# Altium project screwdriver.PrjPcb
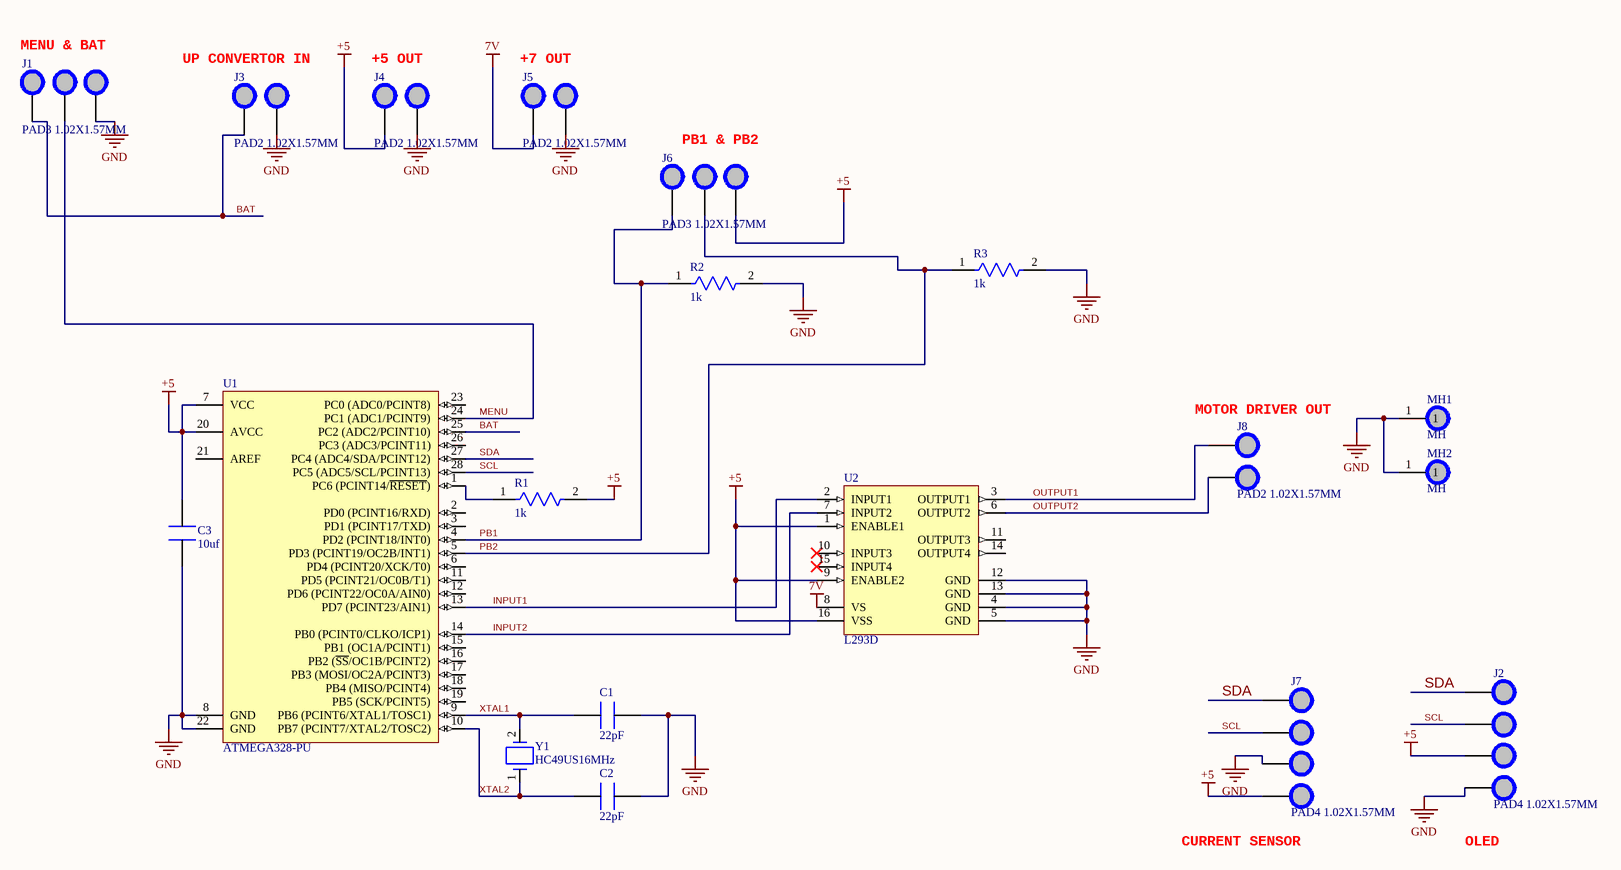
[diagram p0: version_1.SchDoc]
1 sheet, 19 parts. Net scope: global (net labels, ports and power ports of the same name join across sheets).
Board file: version_1.PcbDoc

## Sheet version_1.SchDoc
size D; SheetNumber: 1; SheetTotal: 1

### Parts
C1  22pF  [Capacitor_22pF]
C2  22pF  [Capacitor_22pF]
C3  10uf  [0805 cap]
J1  PAD3 1.02X1.57MM  [PAD3 1.02X1.57MM]  (no BOM)
J2  PAD4 1.02X1.57MM  [PAD4 1.02X1.57MM]  (no BOM)
J3  PAD2 1.02X1.57MM  [PAD2 1.02X1.57MM]  (no BOM)
J4  PAD2 1.02X1.57MM  [PAD2 1.02X1.57MM]  (no BOM)
J5  PAD2 1.02X1.57MM  [PAD2 1.02X1.57MM]  (no BOM)
J6  PAD3 1.02X1.57MM  [PAD3 1.02X1.57MM]  (no BOM)
J7  PAD4 1.02X1.57MM  [PAD4 1.02X1.57MM]  (no BOM)
J8  PAD2 1.02X1.57MM  [PAD2 1.02X1.57MM]  (no BOM)
MH1  MH  [MH]  (no BOM)
MH2  MH  [MH]  (no BOM)
R1  1k  [resistor]
R2  1k  [resistor]
R3  1k  [resistor]
U1  ATMEGA328-PU  [DIP28 7.62MM]
U2  L293D  [DIP16]
Y1  HC49US16MHz  [HC49US16MHz]

### Nets
7V: J5.1 U2.8(VS)
+5: C3.2 J2.3 J4.1 J6.3 J7.4 R1.2 U1.7(VCC) U1.20(AVCC) U2.1(ENABLE1) U2.9(ENABLE2) U2.16(VSS)
GND: C1.2 C2.2 C3.1 J1.3 J2.4 J3.2 J4.2 J5.2 J7.3 MH1.1 MH2.1 R2.2 R3.2 U1.8(GND) U1.22(GND) U2.4(GND) U2.5(GND) U2.12(GND) U2.13(GND)
BAT: J1.1 J3.1 U1.25(PC2_(ADC2/PCINT10))
INPUT1: U1.13(PD7_(PCINT23/AIN1)) U2.2(INPUT1)
INPUT2: U1.14(PB0_(PCINT0/CLKO/ICP1)) U2.7(INPUT2)
MENU: J1.2 U1.24(PC1_(ADC1/PCINT9))
OUTPUT1: J8.1 U2.3(OUTPUT1)
OUTPUT2: J8.2 U2.6(OUTPUT2)
PB1: J6.1 R2.1 U1.4(PD2_(PCINT18/INT0))
PB2: J6.2 R3.1 U1.5(PD3_(PCINT19/OC2B/INT1))
SCL: J2.2 J7.2 U1.28(PC5_(ADC5/SCL/PCINT13))
SDA: J2.1 J7.1 U1.27(PC4_(ADC4/SDA/PCINT12))
XTAL1: C1.1 U1.9(PB6_(PCINT6/XTAL1/TOSC1)) Y1.2
XTAL2: C2.1 U1.10(PB7_(PCINT7/XTAL2/TOSC2)) Y1.1
NetR1_1: R1.1 U1.1(PC6_(PCINT14/~{RESET}))

Not connected (* = marked no-connect by the designer): U1 2(PD0_(PCINT16/RXD)) 3(PD1_(PCINT17/TXD)) 6(PD4_(PCINT20/XCK/T0)) 11(PD5_(PCINT21/OC0B/T1)) 12(PD6_(PCINT22/OC0A/AIN0)) 15(PB1_(OC1A/PCINT1)) 16(PB2_(~{SS}/OC1B/PCINT2)) 17(PB3_(MOSI/OC2A/PCINT3)) 18(PB4_(MISO/PCINT4)) 19(PB5_(SCK/PCINT5)) 21(AREF) 23(PC0_(ADC0/PCINT8)) 26(PC3_(ADC3/PCINT11)); U2 10(INPUT3)* 11(OUTPUT3) 14(OUTPUT4) 15(INPUT4)*

### Notes on the sheet
- (near J1) MENU & BAT
- (near J3) UP CONVERTOR IN
- (near J4) +5 OUT
- (near J5) +7 OUT
- (near J6) PB1 & PB2
- (near J8) MOTOR DRIVER OUT
- (near J7) CURRENT SENSOR
- (near J2) OLED

### Library data of the parts
C1 C2 = VY1220K31U2JQ63V0: Cap Ceramic Suppression X1/Y2 22pF 760VAC/500VAC U2J 10% (8 X 5mm) Radial 10mm 125C Bulk; Manufacturer: Vishay BCcomponents; Voltage Rating: 500V; Temperature Coefficient: 120ppm/°C; Voltage Rating (DC): 250V; Lead/Base Style: Kinked; Lead Diameter: 0.6mm; Lead Length: 30mm; Body Diameter: 8mm; Ratings: X1,Y1; Supplier 1: Mouser; Manufacturer Part Number: VY1220K31U2JQ63V0; RoHS: Yes; Category: Ceramic Capacitors; Stock 1: 27652; Pricing 1: 1=0.37000, 10=0.17900, 50=0.17900, 100=0.15300, 1000=0.09400, 10000=0.08100 (USD); Mount: Through Hole; Case/Package: Radial; Number of Pins: 2; Min Operating Temperature: -40°C; Max Operating Temperature: 125°C; Capacitance: 22pF; Tolerance: 10%; Package Quantity: 1000; Packaging: Bulk; Voltage Rating (AC): 500V; Dielectric: U2J; Termination: Radial; Series: VY1; Construction: RADIAL; Diameter: 8mm; Width: 5mm; Lead Pitch: 10mm; Thickness: 5mm; Depth: 5mm; RoHS Compliant: Yes; ComponentLink1URL: https://datasheet.ciiva.com/149/vy1series-149110.pdf?src-supplier=Digi-Key; ComponentLink1Description: https://datasheet.ciiva.com/149/vy1series-149110.pdf?src-supplier=Digi-Key; ComponentLink2URL: https://datasheet.ciiva.com/5711/1339573-5711482.pdf?src-supplier=Farnell; ComponentLink2Description: https://datasheet.ciiva.com/5711/1339573-5711482.pdf?src-supplier=Farnell; Supplier Part Number 1: 72-VY1220K31U2JQ63V0
C3 = CL21A106KOQNNNE: -; Manufacturer: Samsung; Tolerance: 10%; Voltage Rating: 16V; Dielectric: X7R; Supplier 1: Arrow Electronics; Manufacturer Part Number: CL21A106KOQNNNE; RoHS: Yes; Category: Ceramic Capacitors; Stock 1: 1702000; Pricing 1: 2000=0.0165, 4000=0.0156, 10000=0.0122, 14000=0.0121, 50000=0.0096, 100000=0.0083, 200000=0.0072 (USD); Mount: Surface Mount; Case/Package: 0805; Case Code (Metric): 2012; Case Code (Imperial): 0805; Min Operating Temperature: -55°C; Max Operating Temperature: 85°C; Packaging: Tape and Reel; Capacitance: 10uF; Voltage Rating (DC): 16V; Series: CL; Construction: Flat; Package Quantity: 1; Voltage: 16V; Length: 2mm; Width: 0.049inch; Height: 1.25mm; Depth: 1.25mm; Thickness: 0.055inch; Radiation Hardening: No; Lead Free: Lead Free; RoHS Compliant: Yes; Supplier Part Number 1: CL21A106KOQNNNE
R1-R3 = MRS25000C1001FCT00: MRS25 Series Axial Thin Film Resistor 1kOhms +/-1% 0.6W +/-50ppm/degC; Manufacturer: Vishay; Resistance: 1kR; Tolerance: 1%; Power Rating: 600mW; Temperature Coefficient: 50ppm/°C; Voltage Rating (DC): 350V; Lead Diameter: 0.6mm; Supplier 1: Mouser; Manufacturer Part Number: MRS25000C1001FCT00; RoHS: Yes; Category: Through-Hole Resistors; Stock 1: 28607; Pricing 1: 1=0.28000, 10=0.24200, 50=0.24200, 100=0.09500, 1000=0.04000, 10000=0.03300 (USD); Case/Package: Axial; Number of Pins: 2; Contact Plating: Tin; Weight: 0.00776oz; Min Operating Temperature: -55°C; Max Operating Temperature: 155°C; Packaging: Tape and Reel; Termination: Axial; Series: MRS25; Voltage Rating: 350V; Resistor Type: Metal Film,Thin Film; Resistance Tolerance: 1%; Technology: THIN FILM; Number of Terminations: 2; Package Quantity: 5000; Max Power Dissipation: 600mW; Diameter: 2.5mm; Length: 6.5mm; Width: 2.5mm; Radiation Hardening: No; Lead Free: Lead Free; RoHS Compliant: Yes; Reach SVHC Compliant: Unknown; ComponentLink1URL: https://datasheet.ciiva.com/46412/1756157-46412631.pdf?src-supplier=Element14; ComponentLink1Description: https://datasheet.ciiva.com/46412/1756157-46412631.pdf?src-supplier=Element14; ComponentLink2URL: https://datasheet.ciiva.com/28605/1911198-28605880.pdf?src-supplier=Element14; ComponentLink2Description: https://datasheet.ciiva.com/28605/1911198-28605880.pdf?src-supplier=Element14; ComponentLink3URL: https://datasheet.ciiva.com/7836/mrs16m25-7836234.pdf?src-supplier=Element14; ComponentLink3Description: https://datasheet.ciiva.com/7836/mrs16m25-7836234.pdf?src-supplier=Element14; ComponentLink4URL: https://datasheet.ciiva.com/8401/mrs16m25-8401227.pdf?src-supplier=Avnet; ComponentLink4Description: https://datasheet.ciiva.com/8401/mrs16m25-8401227.pdf?src-supplier=Avnet; ComponentLink5URL: https://datasheet.ciiva.com/16464/mrs16m25-16464630.pdf?src-supplier=Future+Electronics; ComponentLink5Description: https://datasheet.ciiva.com/16464/mrs16m25-16464630.pdf?src-supplier=Future+Electronics; Supplier Part Number 1: 594-MRS251K1%TR
U1 = ATMEGA328-PU: ATmega Series 32 kB Flash 2 kB SRAM 20 MHz 8-Bit Microcontroller - DIP-28; Manufacturer: Microchip; RAM Size: 2KB; Number of I/Os: 23; Number of Timers/Counters: 3; Max Supply Voltage: 5.5V; Min Supply Voltage: 1.8V; Frequency: 20MHz; Number of PWM Channels: 6; Data Bus Width: 8b; Number of SPI Channels: 1; Memory Size: 32KB; Peripherals: POR,PWM,WDT; Core Architecture: AVR; Watchdog Timer: Yes; Supplier 1: Rs; Manufacturer Part Number: ATMEGA328-PU; RoHS: Yes; Stock 1: 871; Pricing 1: 25=0.41080, 100=0.39560 (GBP); Mount: Through Hole; Case/Package: PDIP; Number of Pins: 28; Min Operating Temperature: -40°C; Max Operating Temperature: 85°C; Number of ADC Channels: 6; Max Frequency: 20MHz; Number of I2C Channels: 1; Memory Type: FLASH; Length: 34.8mm; Width: 7.49mm; Height: 4.572mm; Reach SVHC Compliant: No; Lead Free: Lead Free; RoHS Compliant: Yes; Supplier Part Number 1: 1310277P
U2 = L293D: IC MOTOR DRIVER PAR 16-DIP; Manufacturer: STMicroelectronics; Output Current: 600mA; Interface: Parallel; Number of Outputs: 2; Max Supply Voltage: 36V; Min Supply Voltage: 4.5V; Operating Supply Voltage: 24V; Number of Channels: 4; Max Collector Current: 1.2A; Motor Type: Brushed; Operating Supply Current: 2mA; Power Dissipation: 4W; Supplier 1: Mouser; Manufacturer Part Number: L293D; RoHS: Yes; Category: Motor Drivers; Stock 1: 664; Pricing 1: 1=8.52000, 10=7.70000, 50=7.34000, 100=6.37000, 1000=5.07000, 10000=5.07000 (USD); Mount: Through Hole; Case/Package: DIP; Number of Pins: 16; Min Operating Temperature: -40°C; Max Operating Temperature: 150°C; Packaging: Rail/Tube; Series: -; Length: 20mm; Width: 7.1mm; Height: 5.1mm; Radiation Hardening: No; Lead Free: Lead Free; RoHS Compliant: Yes; ComponentLink1URL: https://datasheet.ciiva.com/14150/ocl293d-647107-dat-en-14150297.pdf?src-supplier=Distrelec; ComponentLink1Description: https://datasheet.ciiva.com/14150/ocl293d-647107-dat-en-14150297.pdf?src-supplier=Distrelec; ComponentLink2URL: https://datasheet.ciiva.com/15109/getdatasheetpartid-121660-15109379.pdf?src-supplier=Verical; ComponentLink2Description: https://datasheet.ciiva.com/15109/getdatasheetpartid-121660-15109379.pdf?src-supplier=Verical; ComponentLink3URL: https://datasheet.ciiva.com/29307/156134-da-01-en-4-kanal-treiber-ic-l293d-stm-29307000.pdf?src-supplier=Conrad; ComponentLink3Description: https://datasheet.ciiva.com/29307/156134-da-01-en-4-kanal-treiber-ic-l293d-stm-29307000.pdf?src-supplier=Conrad; ComponentLink4URL: https://datasheet.ciiva.com/1955/cd00000059-1955400.pdf?src-supplier=Digi-Key; ComponentLink4Description: https://datasheet.ciiva.com/1955/cd00000059-1955400.pdf?src-supplier=Digi-Key; ComponentLink5URL: https://datasheet.ciiva.com/4895/cd00000059-4895945.pdf?src-supplier=Mouser; ComponentLink5Description: https://datasheet.ciiva.com/4895/cd00000059-4895945.pdf?src-supplier=Mouser; ComponentLink6URL: https://datasheet.ciiva.com/16458/cd00000059-16458220.pdf?src-supplier=Future+Electronics; ComponentLink6Description: https://datasheet.ciiva.com/16458/cd00000059-16458220.pdf?src-supplier=Future+Electronics; Supplier Part Number 1: 511-L293D
Y1 = HC49US16.384MABJ-UB: CRYSTAL 16.384MHZ 18PF THROUGH HOLE; Frequency: 16.384MHz; Frequency Tolerance: ± 30ppm; Load Capacitance: 18pF;...; Manufacturer: Citizen; Frequency Stability: 50ppm; ESR (Equivalent Series Resistance): 50R; Supplier 1: Farnell; Manufacturer Part Number: HC49US16.384MABJ-UB; RoHS: Yes; Category: Uncategorized; Pricing 1: 1000=0.30200 (GBP); Mount: Through Hole; Min Operating Temperature: -10°C; Max Operating Temperature: 60°C; Frequency Tolerance: 30ppm; Load Capacitance: 18pF; Packaging: Bulk; Package Quantity: 1000; Series: HC-49US; Operating Frequency: 16.384 MHz; Length: 0.453inch; Width: 0.183inch; Height: 0.138inch; Lead Free: Lead Free; Reach SVHC Compliant: Unknown; ComponentLink1URL: https://datasheet.ciiva.com/856/hc-49-u-s-856176.pdf?src-supplier=Digi-Key; ComponentLink1Description: https://datasheet.ciiva.com/856/hc-49-u-s-856176.pdf?src-supplier=Digi-Key; ComponentLink2URL: https://datasheet.ciiva.com/16440/hc-49-u-s-16440933.pdf?src-supplier=Future+Electronics; ComponentLink2Description: https://datasheet.ciiva.com/16440/hc-49-u-s-16440933.pdf?src-supplier=Future+Electronics; ComponentLink3URL: https://datasheet.ciiva.com/28624/9028-28624744.pdf?src-supplier=Element14; ComponentLink3Description: https://datasheet.ciiva.com/28624/9028-28624744.pdf?src-supplier=Element14; Supplier Part Number 1: 1078922